# Altium schematic sheet Processor.SchDoc
size A4; SheetNumber: 3; SheetTotal: 3
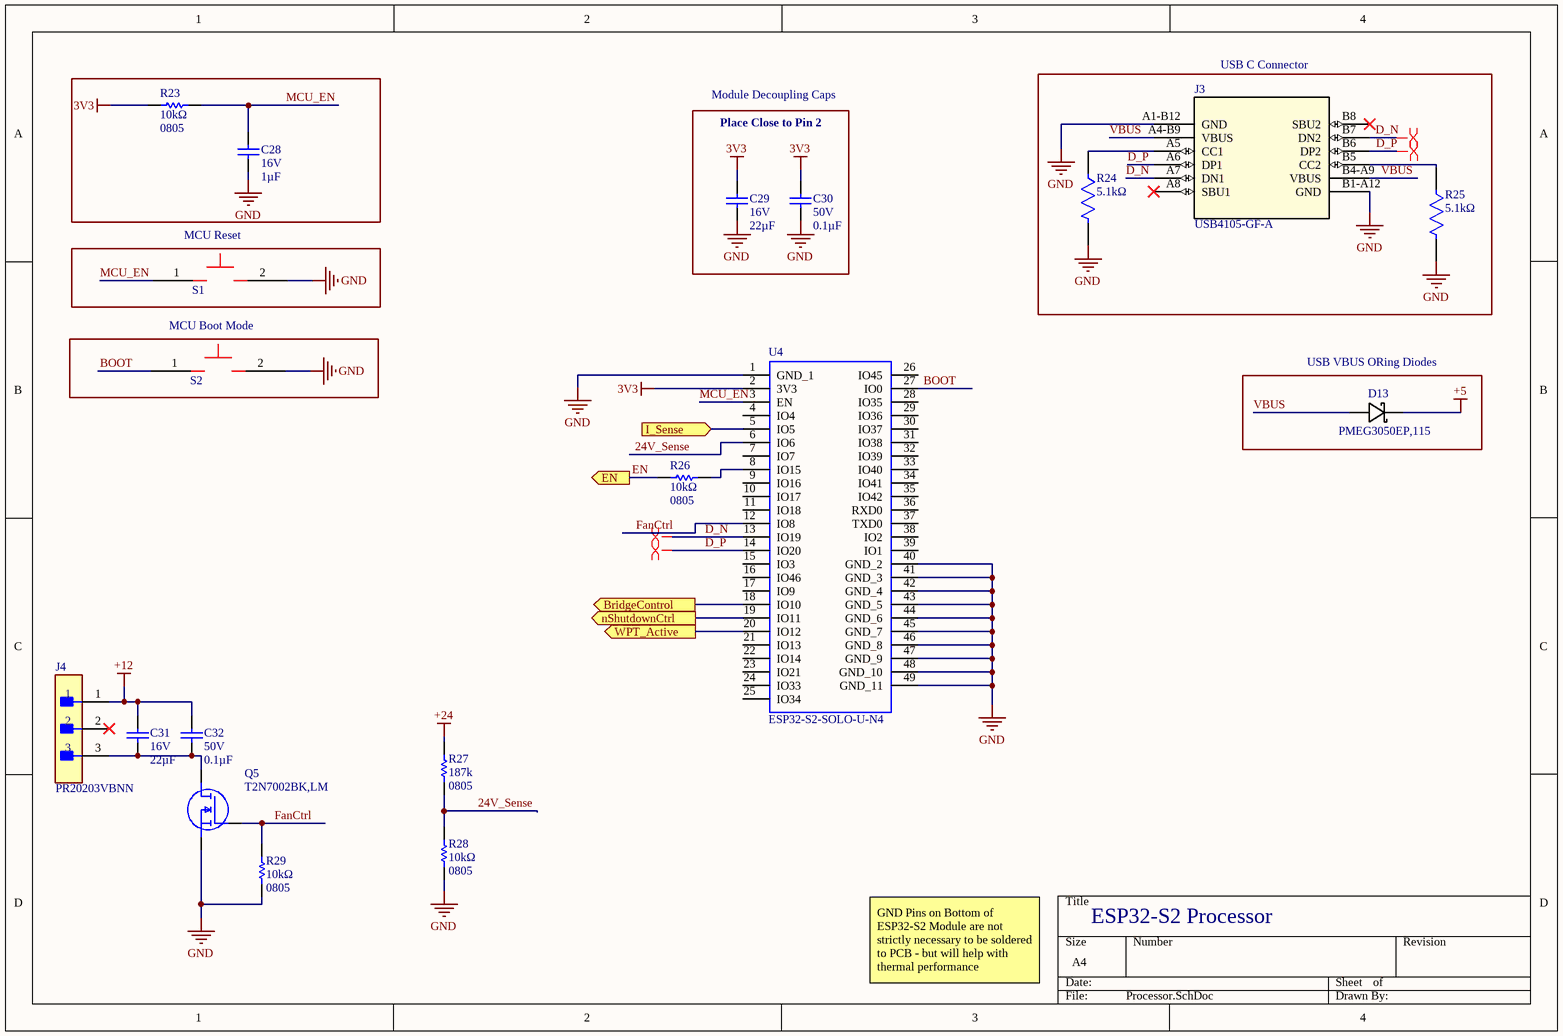
[diagram p0: Processor.SchDoc]

## Parts
C28  Voltage - Rated: 16V  Capacitance: 1µF  [CAP0805]  (hidden comment: GRM21BR71C105KA01L)
C29  Voltage - Rated: 16V  Capacitance: 22µF  [CAP0805]  (hidden comment: CL21A226MOCLRNC)
C30  Voltage - Rated: 50V  Capacitance: 0.1µF  [CAP0805]  (hidden comment: C0805C104K5RACTU)
C31  Voltage - Rated: 16V  Capacitance: 22µF  [CAP0805]  (hidden comment: CL21A226MOCLRNC)
C32  Voltage - Rated: 50V  Capacitance: 0.1µF  [CAP0805]  (hidden comment: C0805C104K5RACTU)
D13  MFG_PN: PMEG3050EP,115  [SOD-128]  (hidden comment: D_PMEG3050EP,115)
J3  USB4105-GF-A  [USB4105_GCT]
J4  PR20203VBNN  [FP-PR20203VBNN-MFG]
Q5  T2N7002BK,LM  [TBAT54CLM]
R23  Resistance: 10kΩ  Package / Case: 0805  [RES0805]  (hidden comment: RC0805FR-0710KL)
R24  Resistance: 5.1kΩ  [FP-CRCW0805-e3-MFG]  (hidden comment: CRCW08055K10FKEA)
R25  Resistance: 5.1kΩ  [FP-CRCW0805-e3-MFG]  (hidden comment: CRCW08055K10FKEA)
R26  Resistance: 10kΩ  Package / Case: 0805  [RES0805]  (hidden comment: RC0805FR-0710KL)
R27  Resistance: 187k  Package: 0805  [RESC2013X70X40NL20T20]  (hidden comment: ERJ-6ENF1873V)
R28  Resistance: 10kΩ  Package / Case: 0805  [RES0805]  (hidden comment: RC0805FR-0710KL)
R29  Resistance: 10kΩ  Package / Case: 0805  [RES0805]  (hidden comment: RC0805FR-0710KL)
S1  RESET  [Tactile_Button_3X6X2]  (value not drawn)
S2  BOOT  [Tactile_Button_3X6X2]  (value not drawn)
U4  ESP32-S2-SOLO-U-N4  [ESP32S2SOLOUN4]

## Blocks framed on the sheet
USB C Connector: J3 R24 R25
MCU Reset: S1
MCU Boot Mode: S2
USB VBUS ORing Diodes: D13

## Ports
BridgeControl (out), EN (out), I_Sense (in), nShutdownCtrl (out), WPT_Active (out)

## Nets
3V3: C29.2 C30.2 R23.1 U4.2(3V3)
+5: D13.2
+12: C31.2 C32.2 J4.1
+24: R27.1
GND: C28.1 C29.1 C30.1 J3.A1-B12(GND) J3.B1-A12(GND) Q5.2(S) R24.2 R25.2 R28.1 R29.1 S1.2 S2.2 U4.1(GND_1) U4.40(GND_2) U4.41(GND_3) U4.42(GND_4) U4.43(GND_5) U4.44(GND_6) U4.45(GND_7) U4.46(GND_8) U4.47(GND_9) U4.48(GND_10) U4.49(GND_11)
24V_Sense: R27.2 R28.2 U4.6(IO6)
BOOT: S2.1 U4.27(IO0)
BridgeControl: U4.18(IO10) ; port BridgeControl
D_N: J3.A7(DN1) J3.B7(DN2) U4.13(IO19)
D_P: J3.A6(DP1) J3.B6(DP2) U4.14(IO20)
EN: R26.1 ; port EN
FanCtrl: Q5.1(G) R29.2 U4.12(IO8)
I_Sense: U4.5(IO5) ; port I_Sense
MCU_EN: C28.2 R23.2 S1.1 U4.3(EN)
nShutdownCtrl: U4.19(IO11) ; port nShutdownCtrl
VBUS: D13.1 J3.A4-B9(VBUS) J3.B4-A9(VBUS)
WPT_Active: U4.20(IO12) ; port WPT_Active
NetC31_1: C31.1 C32.1 J4.3 Q5.3(D)
NetJ3_A5: J3.A5(CC1) R24.1
NetJ3_B5: J3.B5(CC2) R25.1
NetR26_2: R26.2 U4.8(IO15)

Not connected (* = marked no-connect by the designer): J3 A8(SBU1)* B8(SBU2)*; J4 2*; U4 4(IO4) 7(IO7) 9(IO16) 10(IO17) 11(IO18) 15(IO3) 16(IO46) 17(IO9) 21(IO13) 22(IO14) 23(IO21) 24(IO33) 25(IO34) 26(IO45) 28(IO35) 29(IO36) 30(IO37) 31(IO38) 32(IO39) 33(IO40) 34(IO41) 35(IO42) 36(RXD0) 37(TXD0) 38(IO2) 39(IO1)

## Layout directives
differential pair: D_N, D_P

## Notes on the sheet
- Module Decoupling Caps
- Place Close to Pin 2
- ESP32-S2 Processor
- GND Pins on Bottom of ESP32-S2 Module are not strictly necessary to be soldered to PCB - but will help with thermal performance

## Library data of the parts
C28 = GRM21BR71C105KA01L: CAP CER 1UF 16V X7R 0805; Manufacturer: Murata Electronics North America; Tolerance: ±10%; Temperature Coefficient: X7R; Operating Temperature: -55°C ~ 125°C; Supplier 1: Digi-Key; Supplier Part Number 1: 490-1691-1-ND; Package / Case: 0805
C29 C31 = CL21A226MOCLRNC: CAP CER 22UF 16V X5R 0805; Tolerance: ±20%; Supplier 1: Digi-Key; Supplier Part Number 1: 1276-6780-1-ND; Temperature Coefficient: X5R; Footprint: 0805
C30 C32 = C0805C104K5RACTU: CAP CER 0.1UF 50V X7R 0805; Tolerance: ±10%; Supplier 1: Digi-Key; Supplier Part Number 1: 399-1170-1-ND; Temperature Coefficient: X7R; Package / Case: 0805
D13 = D_PMEG3050EP,115: DIODE SCHOTTKY 360mV 30V 5A; MFG: Nexperia; Supplier: Digikey; Supplier_PN: 1727-5317-1-ND
J3 = USB4105-GF-A: No Description Available; Mfr_Name: Global Connector Technology; Copyright: Copyright (C) 2022 Ultra Librarian. All rights reserved.; Manufacturer_Part_Number: USB4105-GF-A; Digi-Key_Part_Number_1: 2073-USB4105-GF-ACT-ND; Digi-Key_Part_Number_2: 2073-USB4105-GF-ADKR-ND; Digi-Key_Part_Number_3: 2073-USB4105-GF-ATR-ND; RefDes: RefDes; Type: DEV
J4 = CMP-77940-000002-1: CONN HEADER VERT 3POS 2.54MM; Manufacturer: Metz Connect; Conn Orientation: Straight; Current Rating: 3A; Number Of Contacts: 3; Conn Gender: Male; Temperature: -40°C to +105°C; Pitch: 2.54mm; Device Class L1: Connectors; Digikey Description: CONN HEADER VERT 3POS 2.54MM; ComponentLink2URL: https://datasheet.octopart.com/PR20203VBNN-Metz-Connect-datasheet-101610322.pdf; Height: 8.6mm; Temperature Range High: +105°C; Manufacturer Part Number: PR20203VBNN; Number Of Rows: 1; Octopart: https://octopart.com/pr20203vbnn-metz+connect-87667116; Device Class L3: unset; ComponentLink2Description: Datasheet; Device Class L2: Headers and Wire Housings; Temperature Range Low: -40°C; Automotive: No; Contact Material: Gold,Nickel; Category: Conn; Lead Free: Yes; RoHS: TRUE; Package: PR20203VBNN
Q5 = T2N7002BK,LM: MOSFET (N-Channel); Manufacturer_Name: Toshiba; Datasheet Link: https://toshiba.semicon-storage.com/info/docget.jsp?did=30376&prodName=T2N7002BK; Height: 1.1mm; Manufacturer_Part_Number: T2N7002BK,LM; Mouser Part Number: 757-T2N7002BKLM; Mouser Price/Stock: https://www.mouser.co.uk/ProductDetail/Toshiba/T2N7002BKLM?qs=lX6dEUlT%252BgfTnU11z%2FTylg%3D%3D; Arrow Part Number: T2N7002BK,LM; Arrow Price/Stock: https://www.arrow.com/en/products/t2n7002bklm/toshiba?region=nac
R23 R26 R28 R29 = RC0805FR-0710KL: RES SMD 10K OHM 1% 1/8W 0805; Manufacturer: Yageo; Power (Watts): 0.125W, 1/8W; Temperature Coefficient: ±100ppm/°C; Supplier 1: Digi-Key; Supplier Part Number 1: 311-10.0KCRCT-ND; Tolerance: ±1%; Composition: Thick Film; Features: Moisture Resistant; Operating Temperature: -55°C ~ 155°C
R24 R25 = CMP-2001-04024-2: RES Thick Film, 5.1kΩ, 1%, 0.125W, 100ppm/°C, 0805; Power Rating: 125mW; Voltage Rating (DC): 150V; Packaging: Tape and Reel; Case Code (Metric): 2012; Contact Plating: Tin; Case Code (Imperial): 0805; Depth: 1.25mm; Tolerance: 1%; Width: 0.049inch; Temperature Coefficient: 100ppm/°C; Max Power Dissipation: 125mW; Military Standard: Not; Lead Free: Lead Free; Mount: Surface Mount; Min Operating Temperature: -55°C; Package Quantity: 10; Weight: 0.000194oz; Height: 0.45mm; Number of Terminations: 2; Max Operating Temperature: 155°C; Termination: SMD/SMT; Case/Package: 0805; Composition: Thick Film; Voltage Rating: 150V; Length: 2mm; Features: Automotive AEC-Q200; Radiation Hardening: No
R27 = CMP-1013-00765-2: Manufacturer: Panasonic; Part Number: ERJ-6ENF1873V
S1 S2 = Tactile Button_3X6X2
U4 = ESP32-S2-SOLO-U-N4: WiFi Modules - 802.11 SMD module, ESP32-S2, 4 MB SPI flash, IPEX antenna; Manufacturer_Name: Espressif Systems; Geometry.Height: 3.35mm; Mouser Part Number: 356-ESP32-S2-SOLOUN4; Mouser Price/Stock: https://www.mouser.co.uk/ProductDetail/Espressif-Systems/ESP32-S2-SOLO-U-N4?qs=pBJMDPsKWf24meOzbFo%252B2g%3D%3D; Manufacturer_Part_Number: ESP32-S2-SOLO-U-N4; Datasheet Link: https://www.espressif.com/sites/default/files/documentation/esp32-s2-solo_esp32-s2-solo-u_datasheet_en.pdf